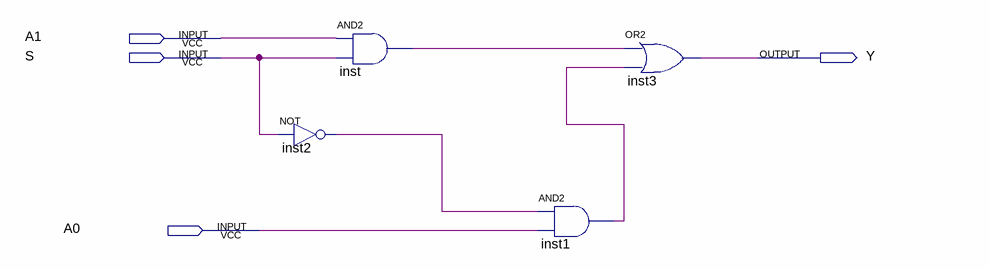
[diagram p0: schematic sheet]
// Quartus schematic mux2x1.bdf as structural Verilog: 4 symbols, 4 pins
module mux2x1 (
  input  A1,
  input  S,
  input  A0,
  output Y
);

  wire inst1_out, inst2_out, inst_out;

  not inst2 (inst2_out, S);
  and inst (inst_out, A1, S);
  and inst1 (inst1_out, inst2_out, A0);
  or inst3 (Y, inst_out, inst1_out);
endmodule
